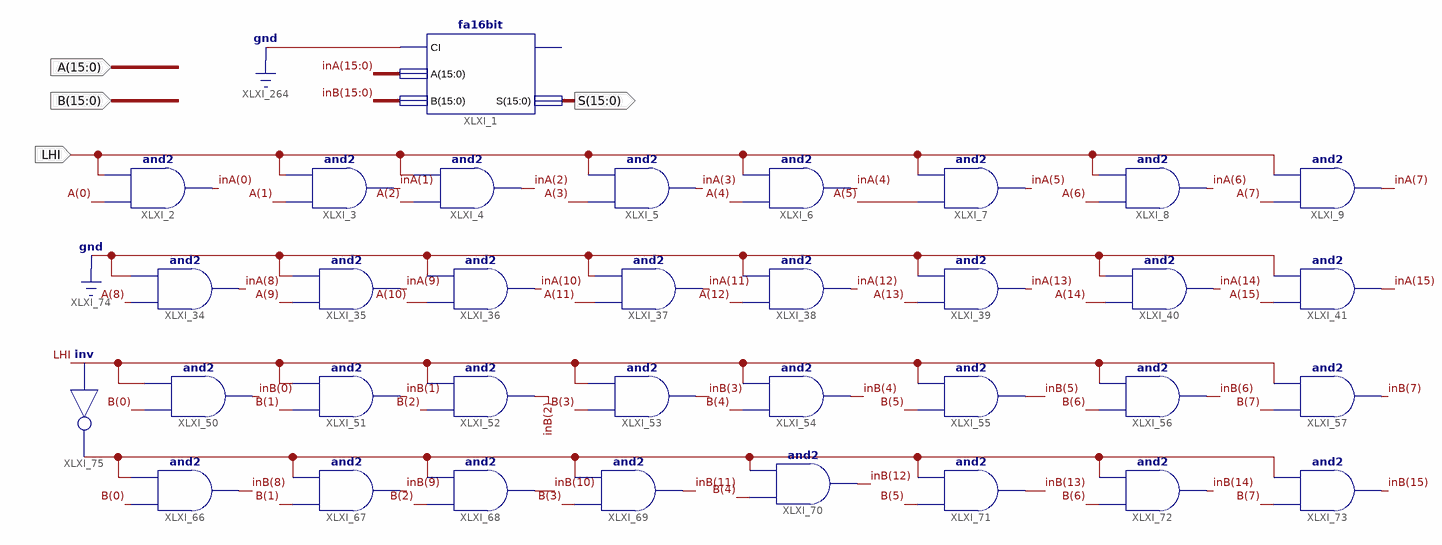
[diagram p0: schematic sheet 1]
// Xilinx ISE schematic LHI.sch (spartan6) as structural Verilog: 34 symbols, 4 ports
module LHI (
  input  LHI,
  input  [15:0] A,
  input  [15:0] B,
  output [15:0] S
);

  wire XLXN_7;
  wire [15:0] inA, inB;

  fa16bit XLXI_1 (.CI(1'b0), .A(inA), .B(inB), .S(S));  // open: Co
  and XLXI_40 (inA[14], A[14], 1'b0);
  and XLXI_70 (inB[12], B[4], XLXN_7);
  and XLXI_73 (inB[15], B[7], XLXN_7);
  and XLXI_57 (inB[7], B[7], LHI);
  and XLXI_41 (inA[15], A[15], 1'b0);
  and XLXI_9 (inA[7], A[7], LHI);
  and XLXI_72 (inB[14], B[6], XLXN_7);
  and XLXI_56 (inB[6], B[6], LHI);
  and XLXI_8 (inA[6], A[6], LHI);
  and XLXI_71 (inB[13], B[5], XLXN_7);
  and XLXI_55 (inB[5], B[5], LHI);
  and XLXI_39 (inA[13], A[13], 1'b0);
  and XLXI_7 (inA[5], A[5], LHI);
  and XLXI_54 (inB[4], B[4], LHI);
  and XLXI_38 (inA[12], A[12], 1'b0);
  and XLXI_6 (inA[4], A[4], LHI);
  and XLXI_69 (inB[11], B[3], XLXN_7);
  and XLXI_37 (inA[11], A[11], 1'b0);
  and XLXI_5 (inA[3], A[3], LHI);
  and XLXI_4 (inA[2], A[2], LHI);
  and XLXI_2 (inA[0], A[0], LHI);
  and XLXI_34 (inA[8], A[8], 1'b0);
  not XLXI_75 (XLXN_7, LHI);
  and XLXI_50 (inB[0], B[0], LHI);
  and XLXI_66 (inB[8], B[0], XLXN_7);
  and XLXI_68 (inB[10], B[2], XLXN_7);
  and XLXI_52 (inB[2], B[2], LHI);
  and XLXI_51 (inB[1], B[1], LHI);
  and XLXI_67 (inB[9], B[1], XLXN_7);
  and XLXI_35 (inA[9], A[9], 1'b0);
  and XLXI_3 (inA[1], A[1], LHI);
  and XLXI_36 (inA[10], A[10], 1'b0);
  and XLXI_53 (inB[3], B[3], LHI);
endmodule
